# Altium schematic sheet Supply.SchDoc: Supply
size A4; SheetNumber: 3; SheetTotal: 4
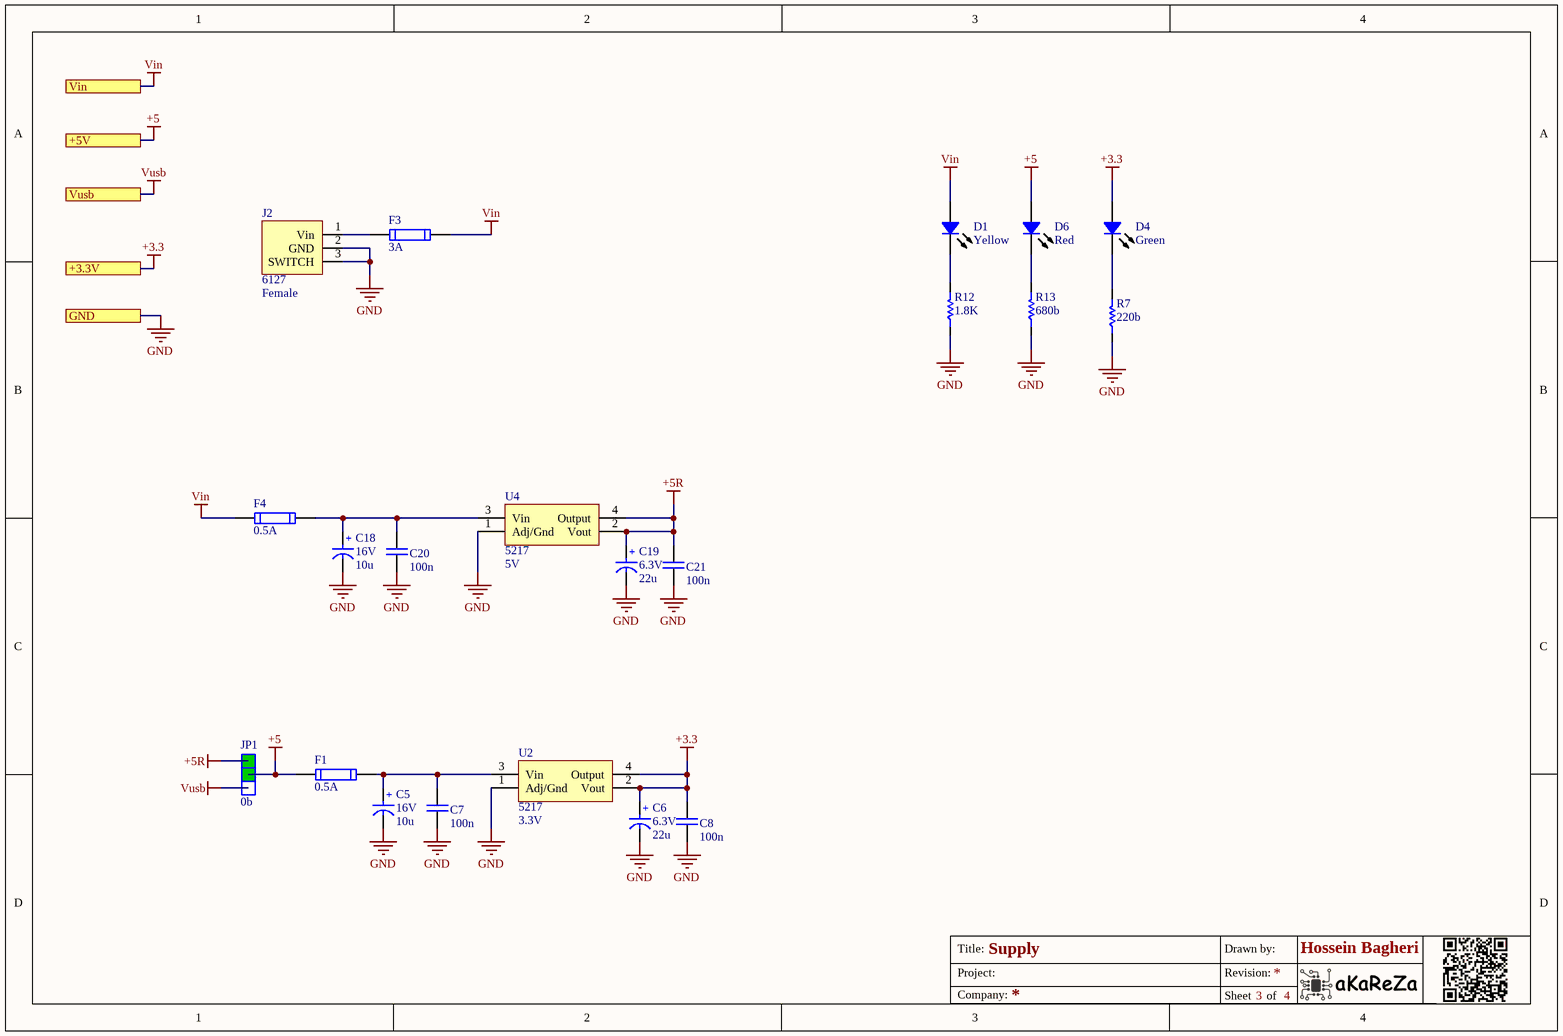
[diagram p0: Supply.SchDoc]

## Parts
C5  Rating: 16V  [SMT_C_Tantalum_A]  (hidden comment: 10u)
C6  Rating: 6.3V  [SMT_C_Tantalum_A]  (hidden comment: 22u)
C7  100n  [CAP 1206/3216]
C8  100n  [CAP 1206/3216]
C18  Rating: 16V  [SMT_C_Tantalum_A]  (hidden comment: 10u)
C19  Rating: 6.3V  [SMT_C_Tantalum_A]  (hidden comment: 22u)
C20  100n  [CAP 1206/3216]
C21  100n  [CAP 1206/3216]
D1  Yellow  [LED 0805/2012 YELLOW]
D4  Green  [LED 0805/2012 GREEN]
D6  Red  [LED 0805/2012 RED]
F1  0.5A  [1206_F]
F3  3A  [1206_F]
F4  0.5A  [1206_F]
J2  Inflow: 6127  [Power Jack BIG]  (hidden comment: Female)
JP1  0b  [jumper selector]
R7  220b  [RES 0805 (2012X06L)]
R12  1.8K  [RES 0805 (2012X06L)]
R13  680b  [RES 0805 (2012X06L)]
U2  Inflow: 5217  [SOT223_M]  (hidden comment: 3.3V)
U4  Inflow: 5217  [SOT223_M]  (hidden comment: 5V)

## Ports
+3.3V, +5V, GND, Vin, Vusb

## Nets
+3.3: C6.1(+) C8.1 D4.1 U2.2(Vout) U2.4(Output) ; port +3.3V
+5: D6.1 F1.1 JP1.2 ; port +5V
+5R: C19.1(+) C21.1 JP1.1 U4.2(Vout) U4.4(Output)
GND: C5.2(-) C6.2(-) C7.2 C8.2 C18.2(-) C19.2(-) C20.2 C21.2 J2.2(GND) J2.3(SWITCH) R7.1 R12.1 R13.1 U2.1(Adj/Gnd) U4.1(Adj/Gnd) ; port GND
Vin: D1.1 F3.2 F4.1 ; port Vin
Vusb: JP1.3 ; port Vusb
NetC5_1: C5.1(+) C7.1 F1.2 U2.3(Vin)
NetC18_1: C18.1(+) C20.1 F4.2 U4.3(Vin)
NetD1_2: D1.2 R12.2
NetD4_2: D4.2 R7.2
NetD6_2: D6.2 R13.2
NetF3_1: F3.1 J2.1(Vin)

## Notes on the sheet
- Title:
- Project:
- Drawn by:
- Revision:
- Hossein Bagheri
- Company:
- Sheet
- of

## Library data of the parts
C5 C6 C18 C19 = Cap_Tantalum: Tantalum Capacitor,TAJ Series-SMD; Inflow: inflow?; Validation: Valid; Package: Package?; Type: Tantalum
  C5 C18: Value: 10u
  C6 C19: Value: 22u
C7 C8 C20 C21 = Cap_Multi_SMD_100nF_1206: Bipolar ceramic capacitor SMD; Type: MultiLayer; Inflow: inflow?; Rating: 50V; Validation: Valid; Package: 1206; Value: 100n
D1 D4 D6 = Semi_LED_SMD: LED; Inflow: inflow?; Rating: Rating?; Validation: Valid; Package: Package?; Type: LED
  D1: Value: Yellow
  D4: Value: Green
  D6: Value: Red
F1 F3 F4 = Other_Elec_Fuse_SMD: Short circiut  protection; Inflow: inflow?; Type: Fast; Rating: Rating?; Validation: Valid; Package: 1206
  F1 F4: Value: 0.5A
  F3: Value: 3A
J2 = Con_Power_Jack: Power Jack; Rating: Rating?; Validation: Valid; Type: Type?; Package: Package?; Value: Female
JP1 = SW_Other_JSelector_Dip: Jumper Selector; Rating: Rating?; Inflow: 5145; Validation: NT; Package: Dip; Type: Selector; Value: 0b
R7 R12 R13 = Res_SMD_0805: Resistor; Inflow: inflow?; Rating: 0.125W; Validation: Valid; Package: 0805; Type: 10%
  R7: Value: 220b
  R12: Value: 1.8K
  R13: Value: 680b
U2 U4 = IC_Reg_AMS1117_3.3: 1'A Positive voltage regulator; Rating: 1A; Validation: Valid; Type: LDO; Package: SOT223
  U2: Value: 3.3V
  U4: Value: 5V